# Altium schematic sheet config-bank2.SchDoc: Config FPGA - Bank 2
size Letter; CheckedBy: E. Chiu; CompanyName: Brinton Engineering, LLC; DrawnBy: J. Brinton; Engineer: J. Brinton; Address1: 3479 Edison Way; Address2: Menlo Park CA 94025; Address3: +1 (877) 778-8435; Address4: brintonengineering.com; Revision: 1; SheetNumber: 20; SheetTotal: 71
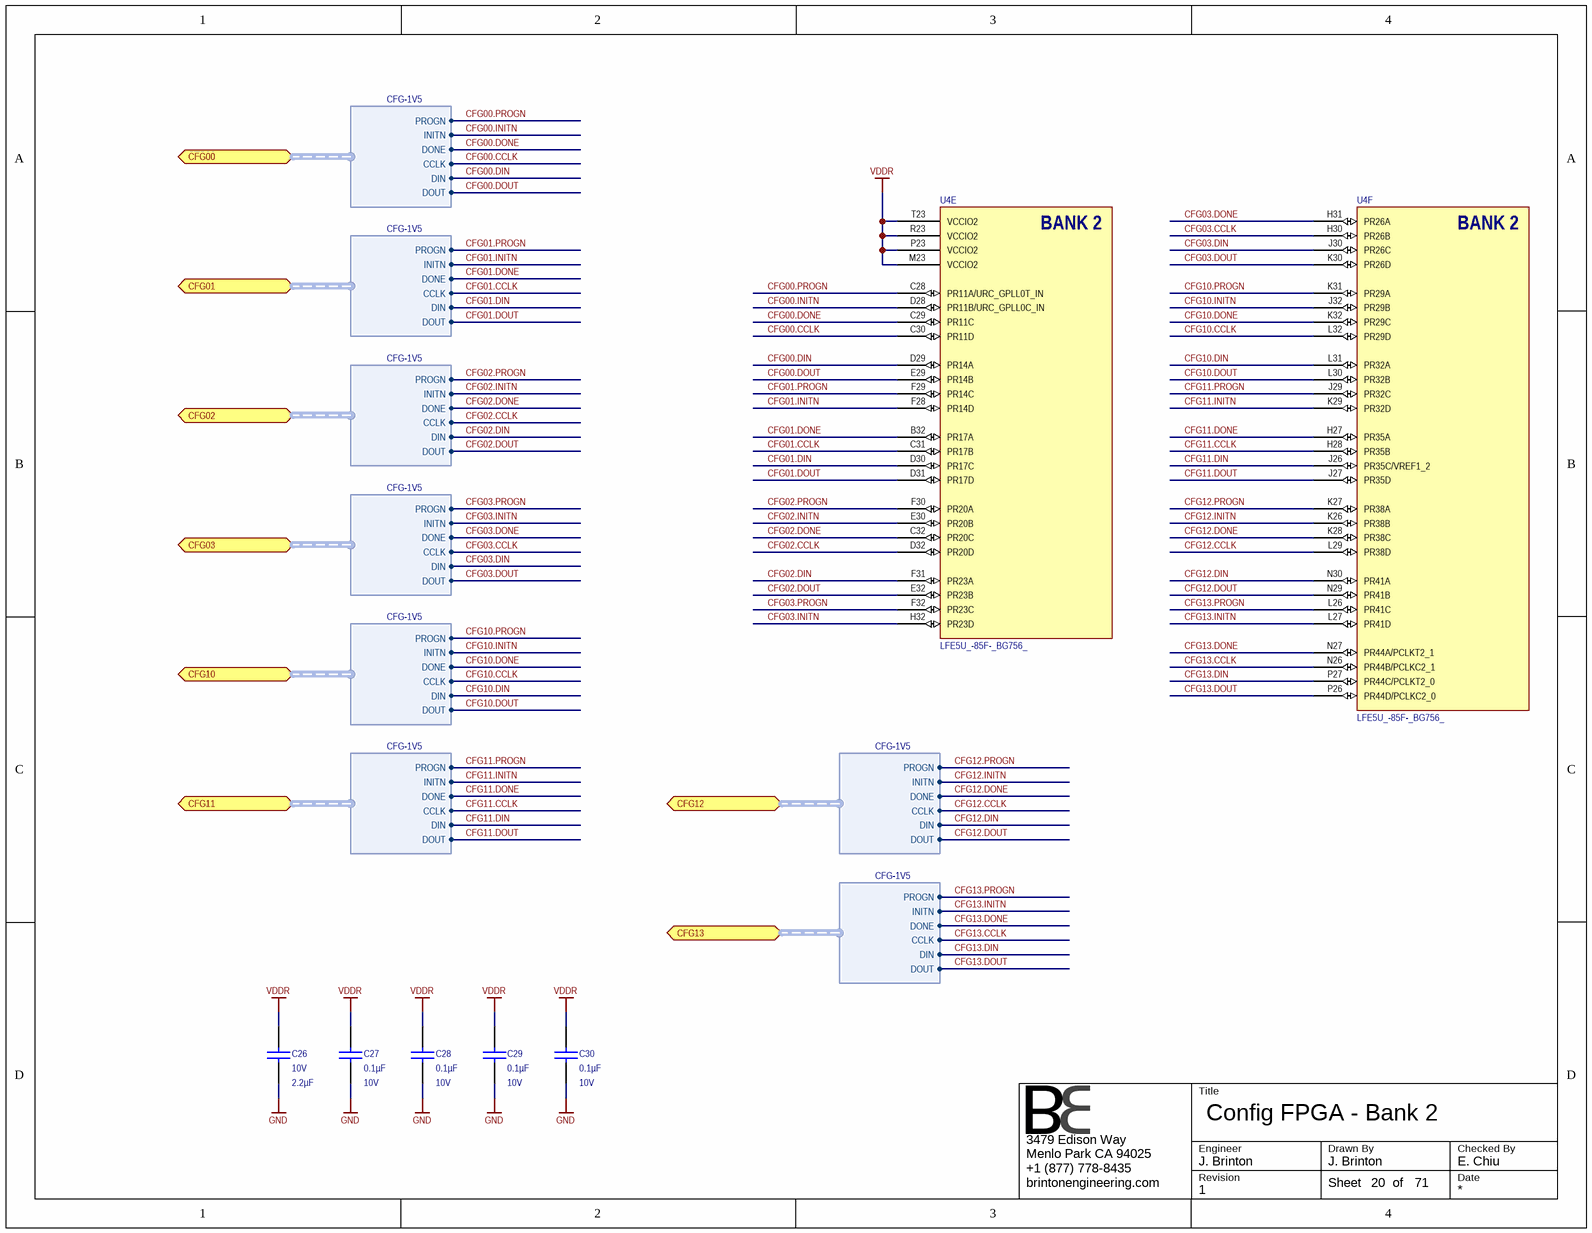
[diagram p0: config-bank2.SchDoc]

## Parts
C26  Voltage - Rated: 10V  Capacitance: 2.2µF  [CAPC1608X90N]  (hidden comment: GRM188R71A225KE15D)
C27  Capacitance: 0.1µF  Voltage - Rated: 10V  [CAPC1005X56N]  (hidden comment: GRM155R71A104KA01J)
C28  Capacitance: 0.1µF  Voltage - Rated: 10V  [CAPC1005X56N]  (hidden comment: GRM155R71A104KA01J)
C29  Capacitance: 0.1µF  Voltage - Rated: 10V  [CAPC1005X56N]  (hidden comment: GRM155R71A104KA01J)
C30  Capacitance: 0.1µF  Voltage - Rated: 10V  [CAPC1005X56N]  (hidden comment: GRM155R71A104KA01J)
U4  LFE5U_-85F-_BG756_  [caBGA756]  (parts E,F of 19)

## Ports
CFG00 (harness CFG-1V5), CFG01 (harness CFG-1V5), CFG02 (harness CFG-1V5), CFG03 (harness CFG-1V5), CFG10 (harness CFG-1V5), CFG11 (harness CFG-1V5), CFG12 (harness CFG-1V5), CFG13 (harness CFG-1V5)

## Harnesses
CFG-1V5: PROGN, INITN, DONE, CCLK, DIN, DOUT

## Nets
GND: C26.1 C27.1 C28.1 C29.1 C30.1
VDDR: C26.2 C27.2 C28.2 C29.2 C30.2 U4.M23(VCCIO2) U4.P23(VCCIO2) U4.R23(VCCIO2) U4.T23(VCCIO2)
CFG00.CCLK: U4.C30(PR11D) ; port CFG00.CCLK
CFG00.DIN: U4.D29(PR14A) ; port CFG00.DIN
CFG00.DONE: U4.C29(PR11C) ; port CFG00.DONE
CFG00.DOUT: U4.E29(PR14B) ; port CFG00.DOUT
CFG00.INITN: U4.D28(PR11B/URC_GPLL0C_IN) ; port CFG00.INITN
CFG00.PROGN: U4.C28(PR11A/URC_GPLL0T_IN) ; port CFG00.PROGN
CFG01.CCLK: U4.C31(PR17B) ; port CFG01.CCLK
CFG01.DIN: U4.D30(PR17C) ; port CFG01.DIN
CFG01.DONE: U4.B32(PR17A) ; port CFG01.DONE
CFG01.DOUT: U4.D31(PR17D) ; port CFG01.DOUT
CFG01.INITN: U4.F28(PR14D) ; port CFG01.INITN
CFG01.PROGN: U4.F29(PR14C) ; port CFG01.PROGN
CFG02.CCLK: U4.D32(PR20D) ; port CFG02.CCLK
CFG02.DIN: U4.F31(PR23A) ; port CFG02.DIN
CFG02.DONE: U4.C32(PR20C) ; port CFG02.DONE
CFG02.DOUT: U4.E32(PR23B) ; port CFG02.DOUT
CFG02.INITN: U4.E30(PR20B) ; port CFG02.INITN
CFG02.PROGN: U4.F30(PR20A) ; port CFG02.PROGN
CFG03.CCLK: U4.H30(PR26B) ; port CFG03.CCLK
CFG03.DIN: U4.J30(PR26C) ; port CFG03.DIN
CFG03.DONE: U4.H31(PR26A) ; port CFG03.DONE
CFG03.DOUT: U4.K30(PR26D) ; port CFG03.DOUT
CFG03.INITN: U4.H32(PR23D) ; port CFG03.INITN
CFG03.PROGN: U4.F32(PR23C) ; port CFG03.PROGN
CFG10.CCLK: U4.L32(PR29D) ; port CFG10.CCLK
CFG10.DIN: U4.L31(PR32A) ; port CFG10.DIN
CFG10.DONE: U4.K32(PR29C) ; port CFG10.DONE
CFG10.DOUT: U4.L30(PR32B) ; port CFG10.DOUT
CFG10.INITN: U4.J32(PR29B) ; port CFG10.INITN
CFG10.PROGN: U4.K31(PR29A) ; port CFG10.PROGN
CFG11.CCLK: U4.H28(PR35B) ; port CFG11.CCLK
CFG11.DIN: U4.J26(PR35C/VREF1_2) ; port CFG11.DIN
CFG11.DONE: U4.H27(PR35A) ; port CFG11.DONE
CFG11.DOUT: U4.J27(PR35D) ; port CFG11.DOUT
CFG11.INITN: U4.K29(PR32D) ; port CFG11.INITN
CFG11.PROGN: U4.J29(PR32C) ; port CFG11.PROGN
CFG12.CCLK: U4.L29(PR38D) ; port CFG12.CCLK
CFG12.DIN: U4.N30(PR41A) ; port CFG12.DIN
CFG12.DONE: U4.K28(PR38C) ; port CFG12.DONE
CFG12.DOUT: U4.N29(PR41B) ; port CFG12.DOUT
CFG12.INITN: U4.K26(PR38B) ; port CFG12.INITN
CFG12.PROGN: U4.K27(PR38A) ; port CFG12.PROGN
CFG13.CCLK: U4.N26(PR44B/PCLKC2_1) ; port CFG13.CCLK
CFG13.DIN: U4.P27(PR44C/PCLKT2_0) ; port CFG13.DIN
CFG13.DONE: U4.N27(PR44A/PCLKT2_1) ; port CFG13.DONE
CFG13.DOUT: U4.P26(PR44D/PCLKC2_0) ; port CFG13.DOUT
CFG13.INITN: U4.L27(PR41D) ; port CFG13.INITN
CFG13.PROGN: U4.L26(PR41C) ; port CFG13.PROGN

## Notes on the sheet
- Title
- Engineer
- Revision
- Drawn By
- Checked By
- Date
- Sheet
- of
- (in symbol LFE5U_-85F-_BG756_, part E) BANK 2
- (in symbol LFE5U_-85F-_BG756_, part F) BANK 2

## Library data of the parts
C26 = GRM188R71A225KE15D: CAP CER 2.2UF 10V 10% X7R 0603; Manufacturer: Murata Electronics North America; Manufacturer P/N: GRM188R71A225KE15D; Operating Temperature: -55°C ~ 125°C; Thickness (Max): 0.035" (0.90mm); Tolerance: ±10%; Package / Case: 0603 (1608 Metric); Temperature Coefficient: X7R; Supplier 1: Newark; Supplier 2: Digi-Key; RoHS: RoHS Compliant; Size / Dimension: 0.063" L x 0.031" W (1.60mm x 0.80mm); Mounting Type: Surface Mount, MLCC; ComponentLink1URL: http://www.murata.com/~/media/webrenewal/support/library/catalog/products/capacitor/mlcc/c02e.ashx; ComponentLink1Description: http://www.murata.com/~/media/webrenewal/support/library/catalog/products/capacitor/mlcc/c02e.ashx; Supplier Part Number 1: 72R4209; Supplier Part Number 2: 490-4520-1-ND
C27-C30 = GRM155R71A104KA01J: CAP CER 0.1UF 10V 10% X7R 0402; Manufacturer: Murata Electronics North America; Manufacturer P/N: GRM155R71A104KA01J; Operating Temperature: -55°C ~ 125°C; Thickness (Max): 0.022" (0.55mm); Size / Dimension: 0.039" L x 0.020" W (1.00mm x 0.50mm); RoHS: RoHS Compliant; Mounting Type: Surface Mount, MLCC; Supplier 1: Digi-Key; ComponentLink1URL: http://www.murata.com/~/media/webrenewal/support/library/catalog/products/capacitor/mlcc/c02e.ashx; ComponentLink1Description: http://www.murata.com/~/media/webrenewal/support/library/catalog/products/capacitor/mlcc/c02e.ashx; Supplier Part Number 1: 490-6322-1-ND; Temperature Coefficient: X7R; Package / Case: 0402 (1005 Metric); Tolerance: ±10%
U4 = LFE5U_-85F-_BG756_: ECP5 FPGA, 85k LUT, 756-caBGA; Manufacturer: Lattice Semiconductor; Manufacturer P/N: LFE5U_-85F-_BG756_